# EAGLE board bms_slave (EAGLE 7.5.0)
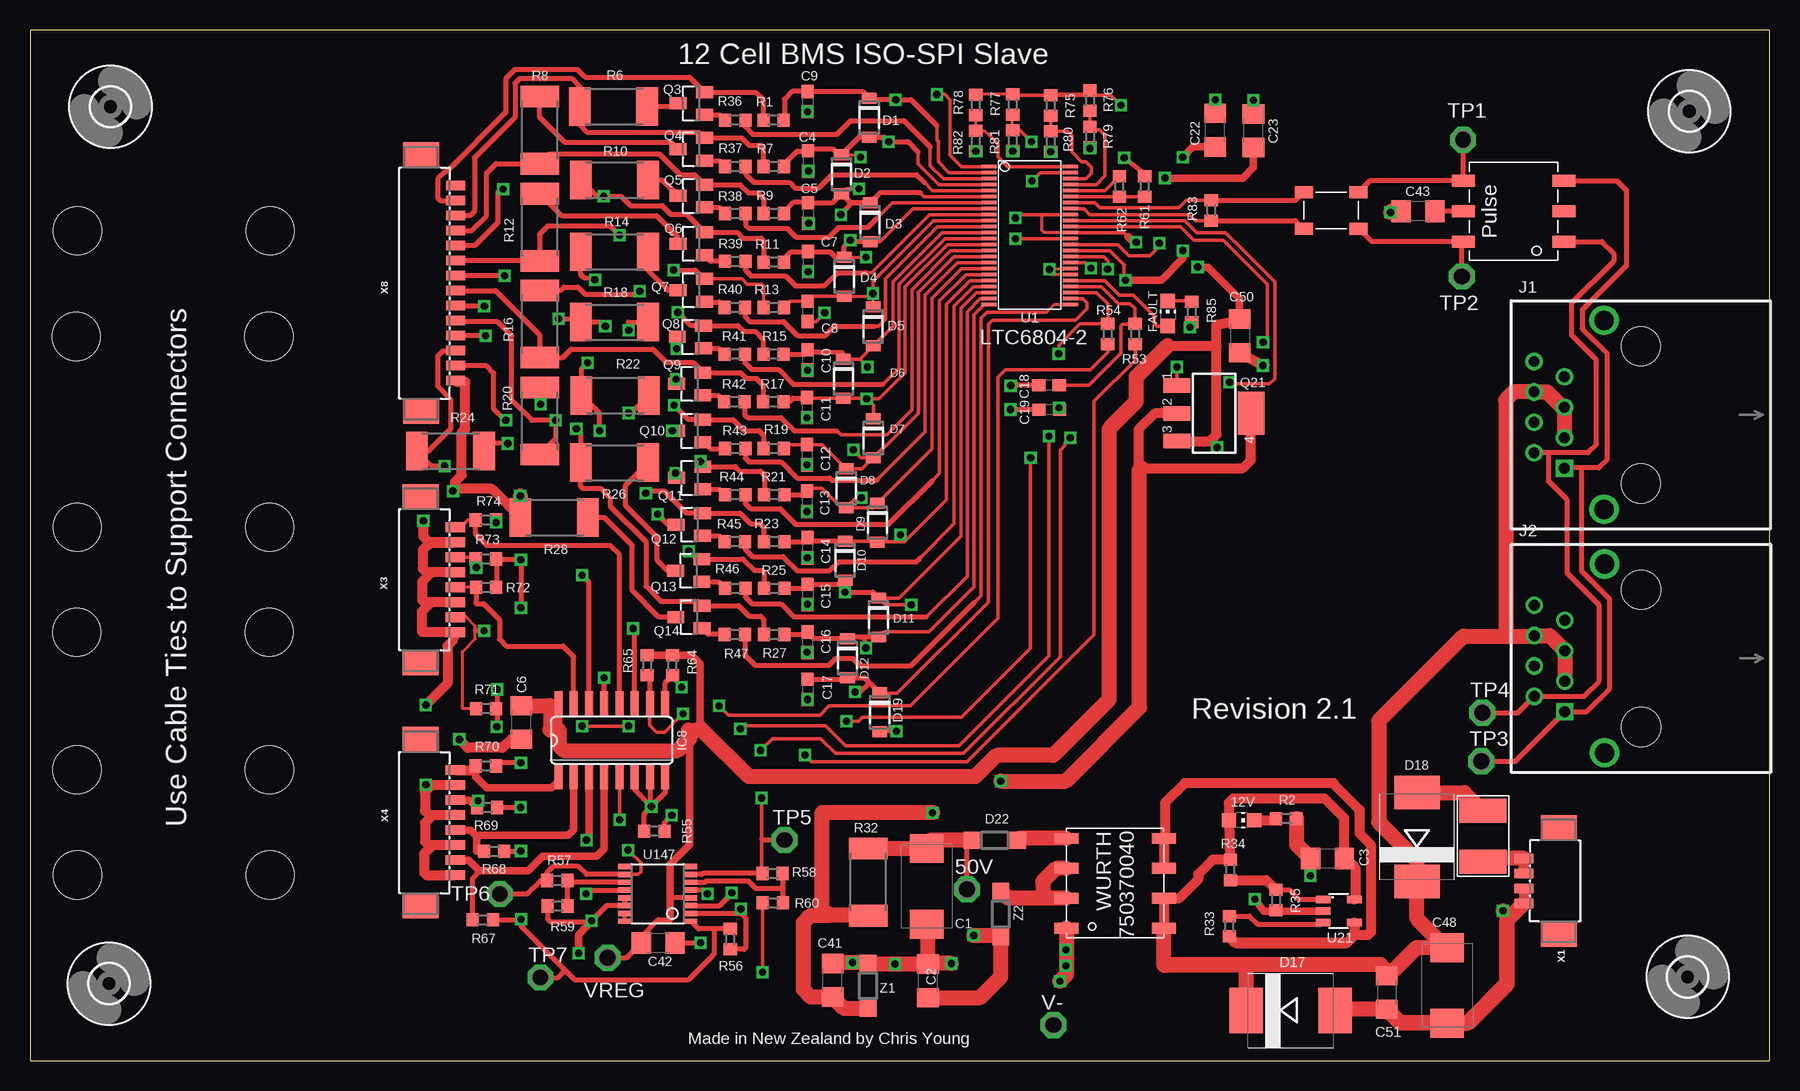
[diagram p2: board, top side]
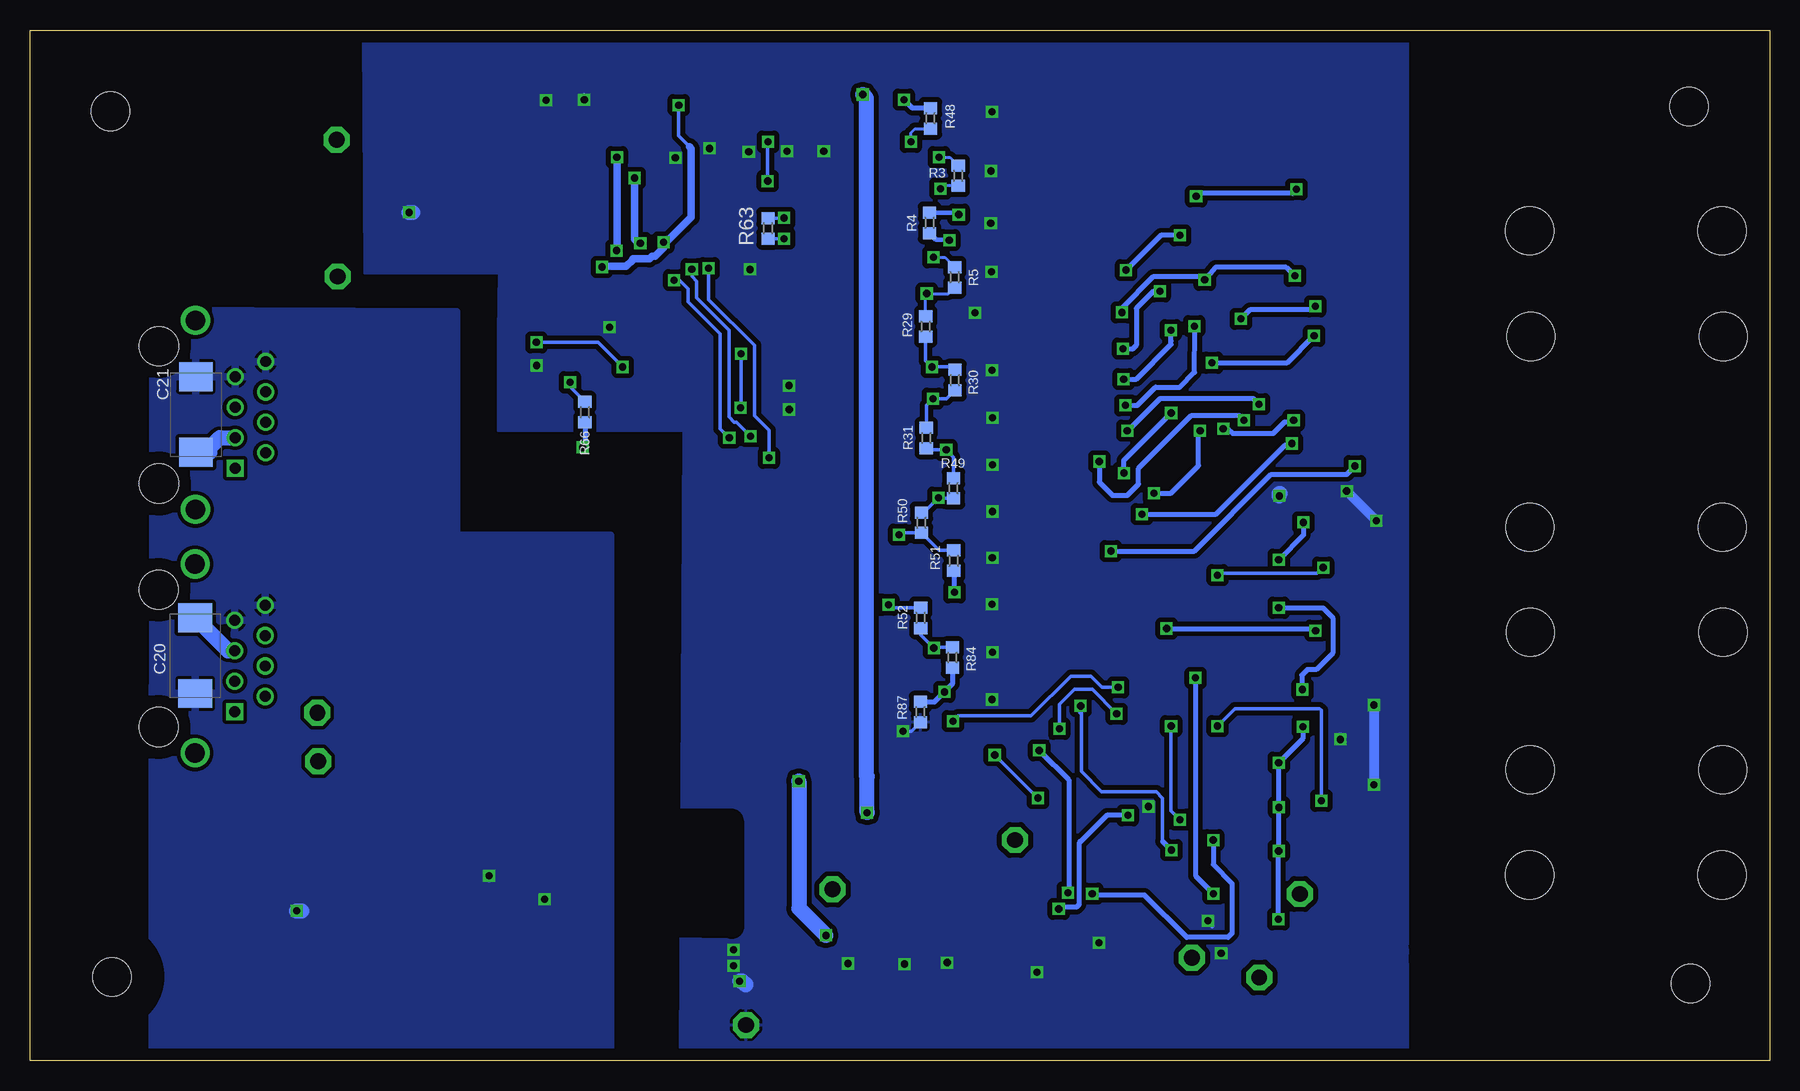
[diagram p3: board, bottom side, seen from below]

Size 145.01 x 85.89 mm. Coordinates in mm from the lower left corner, seen from the top.
Outline: 0,0 145.01,0 145.01,85.89 0,85.89 0,0
Copper layers (1*16): Top 0.035mm / dielectric 1.5mm / Bottom 0.035mm
Design rules "default *": minimum track width 6mil, minimum drill 12mil, track to track 6mil, track to pad 6mil, pad to pad 6mil, via to via 6mil, smd to smd 0mil, copper to edge 40mil, drill to drill 8mil, minimum pad ring 10mil, minimum via ring 8mil, stop-mask expansion 4mil, vias tented up to drill 0mil, thermal gap 10mil
Net classes: 0 default: drill 0.305 mm, clearance 0.152 mm; 1 POWER_12V: width 0.61 mm, drill 0.305 mm, clearance 0.254 mm to class 0, clearance 0.152 mm; 2 POWER_5V: width 0.61 mm, drill 0.305 mm, clearance 0.254 mm to class 0, clearance 0.254 mm to class 1, clearance 0.152 mm; 3 BMS V-: width 0.254 mm, drill 0.305 mm, clearance 0.152 mm to class 0, clearance 2 mm to class 1, clearance 2 mm to class 2, clearance 0.152 mm; 4 V-+1: width 0.254 mm, drill 0.305 mm, clearance 0.152 mm to class 0, clearance 2 mm to class 1, clearance 2 mm to class 2, clearance 0.152 mm to class 3, clearance 0.152 mm; 5 V-+2: width 0.254 mm, drill 0.305 mm, clearance 0.152 mm to class 0, clearance 2 mm to class 1, clearance 2 mm to class 2, clearance 0.33 mm to class 3, clearance 0.152 mm to class 4, clearance 0.152 mm; 6 V-+3: width 0.254 mm, drill 0.305 mm, clearance 0.152 mm to class 0, clearance 2 mm to class 1, clearance 2 mm to class 2, clearance 0.356 mm to class 3, clearance 0.33 mm to class 4, clearance 0.152 mm to class 5, clearance 0.152 mm; 7 V-+4: width 0.254 mm, drill 0.305 mm, clearance 0.152 mm to class 0, clearance 2 mm to class 1, clearance 2 mm to class 2, clearance 0.381 mm to class 3, clearance 0.356 mm to class 4, clearance 0.33 mm to class 5, clearance 0.152 mm to class 6, clearance 0.152 mm; 8 V-+5: width 0.254 mm, drill 0.305 mm, clearance 0.152 mm to class 0, clearance 2 mm to class 1, clearance 2 mm to class 2, clearance 0.406 mm to class 3, clearance 0.381 mm to class 4, clearance 0.356 mm to class 5, clearance 0.33 mm to class 6, clearance 0.152 mm to class 7, clearance 0.152 mm; 9 V-+6: width 0.254 mm, drill 0.305 mm, clearance 0.152 mm to class 0, clearance 2 mm to class 1, clearance 2 mm to class 2, clearance 0.432 mm to class 3, clearance 0.406 mm to class 4, clearance 0.381 mm to class 5, clearance 0.356 mm to class 6, clearance 0.33 mm to class 7, clearance 0.152 mm to class 8, clearance 0.152 mm; 10 V-+7: width 0.254 mm, drill 0.305 mm, clearance 0.152 mm to class 0, clearance 2 mm to class 1, clearance 2 mm to class 2, clearance 0.457 mm to class 3, clearance 0.432 mm to class 4, clearance 0.406 mm to class 5, clearance 0.381 mm to class 6, clearance 0.356 mm to class 7, clearance 0.33 mm to class 8, clearance 0.152 mm to class 9, clearance 0.152 mm; 11 V-+8: width 0.254 mm, drill 0.305 mm, clearance 0.152 mm to class 0, clearance 2 mm to class 1, clearance 2 mm to class 2, clearance 0.483 mm to class 3, clearance 0.457 mm to class 4, clearance 0.432 mm to class 5, clearance 0.406 mm to class 6, clearance 0.381 mm to class 7, clearance 0.356 mm to class 8, clearance 0.33 mm to class 9, clearance 0.152 mm to class 10, clearance 0.152 mm; 12 GND: width 0.406 mm, drill 0.305 mm, clearance 0.3 mm to class 0, clearance 0.381 mm to class 1, clearance 0.381 mm to class 2, clearance 0.483 mm to class 3, clearance 0.457 mm to class 4, clearance 0.432 mm to class 5, clearance 0.406 mm to class 6, clearance 0.381 mm to class 7, clearance 0.356 mm to class 8, clearance 0.33 mm to class 9, clearance 0.152 mm to class 10, clearance 0.152 mm to class 11, clearance 0.152 mm
Holes 4 mm at 20.02,69.16 19.91,60.35 19.99,44.45 19.94,35.71 19.96,24.26 20.02,15.47 3.96,69.16 3.86,60.35 3.94,44.45 3.89,35.71 3.91,24.26 3.96,15.47
bRestrict: area 86.5,11.2 to 91.4,20

## Footprints (pad centres in the part's own frame; a part is rotated, then mirrored left to right if it is on the bottom)
CHIP-LED0805 = smd 1.2 x 1.2: A 0,-1.05; C 0,1.05
P1-13 = drill 1.321 pad 2.159 octagon: TP 0,0
SMC_D = smd 2.4 x 2.8: + -3.15,0; - 3.15,0
C1206 = smd 1.6 x 1.8: 1 -1.4,0; 2 1.4,0
C0603@1 = smd 1.1 x 1: 1 -0.85,0; 2 0.85,0
C1206@1 = smd 1.6 x 1.8: 1 -1.4,0; 2 1.4,0
SOD123FL = smd 0.91 x 1.22: A 1.625,0; C -1.625,0
SMC = smd 2.8 x 3.8: A 3.7,0; C -3.7,0
SOD123 = smd 1.4 x 1.4: A 1.9,0; C -1.9,0
1812 = smd 2 x 3.9: P$1 0,-0.03; P$2 4.25,-0.03
3,2 = hole 3.2: 0,0
SO16 = smd 0.66 x 2.032: 1 -4.445,-3.073; 2 -3.175,-3.073; 3 -1.905,-3.073; 4 -0.635,-3.073; 5 0.635,-3.073; 6 1.905,-3.073; 7 3.175,-3.073; 8 4.445,-3.073; 9 4.445,3.073; 10 3.175,3.073; 11 1.905,3.073; 12 0.635,3.073; 13 -0.635,3.073; 14 -1.905,3.073; 15 -3.175,3.073; 16 -4.445,3.073
J0-C/D/E = drill 0.914 square: 1 4.445,-6.35 | drill 0.914: 2 3.175,-8.89; 3 1.905,-6.35; 4 0.635,-8.89; 5 -0.635,-6.35; 6 -1.905,-8.89; 7 -3.175,-6.35; 8 -4.445,-8.89 | drill 1.626: S1 -7.874,-3.048; S2 7.874,-3.048 | hole 3.251: -5.715,0; 5.715,0
SOT23 = smd 1 x 1.4: 1 -0.95,-1.1; 2 0.95,-1.1; 3 0,1.1
SOT223 = smd 1.219 x 2.235: 1 -2.311,-3.099; 2 0,-3.099; 3 2.311,-3.099 | smd 3.6 x 2.2: 4 0,3.099
R0603 = smd 1 x 1.1: 1 -0.85,0; 2 0.85,0
R2512 = smd 1.8 x 3.2: 1 -2.8,0; 2 2.8,0
SSOP48 = smd 0.3 x 1.25: 1 0.02,-0.01; 2 0.52,-0.01; 3 1.02,-0.01; 4 1.52,-0.01; 5 2.02,-0.01; 6 2.52,-0.01; 7 3.02,-0.01; 8 3.52,-0.01; 9 4.02,-0.01; 10 4.52,-0.01; 11 5.02,-0.01; 12 5.52,-0.01; 13 6.02,-0.01; 14 6.52,-0.01; 15 7.02,-0.01; 16 7.52,-0.01; 17 8.02,-0.01; 18 8.52,-0.01; 19 9.02,-0.01; 20 9.52,-0.01; 21 10.02,-0.01; 22 10.52,-0.01; 23 11.02,-0.01; 24 11.52,-0.01; 25 11.52,6.79; 26 11.02,6.79; 27 10.52,6.79; 28 10.02,6.79; 29 9.52,6.79; 30 9.02,6.79; 31 8.52,6.79; 32 8.02,6.79; 33 7.52,6.79; 34 7.02,6.79; 35 6.52,6.79; 36 6.02,6.79; 37 5.52,6.79; 38 5.02,6.79; 39 4.52,6.79; 40 4.02,6.79; 41 3.52,6.79; 42 3.02,6.79; 43 2.52,6.79; 44 2.02,6.79; 45 1.52,6.79; 46 1.02,6.79; 47 0.52,6.79; 48 0.02,6.79
TSOT23-5 = smd 0.62 x 1.22: 1 -0.95,-1.3; 2 0,-1.3; 3 0.95,-1.3; 4 0.95,1.3; 5 -0.95,1.3
TSSOP16 = smd 0.45 x 1.05: 1 -2.275,-2.768; 2 -1.625,-2.768; 3 -0.975,-2.768; 4 -0.325,-2.768; 5 0.325,-2.768; 6 0.975,-2.768; 7 1.625,-2.768; 8 2.275,-2.768; 9 2.275,2.768; 10 1.625,2.768; 11 0.975,2.768; 12 0.325,2.768; 13 -0.325,2.768; 14 -0.975,2.768; 15 -1.625,2.768; 16 -2.275,2.768
DLW43S = smd 1 x 1.5: P$1 0,0; P$2 0,4.572; P$3 3.048,4.572; P$4 3.048,0
T3001NL = smd 1.016 x 1.905: P$1 0,0; P$2 2.54,0; P$3 5.08,0; P$4 5.08,8.382; P$5 2.54,8.382; P$6 0,8.382
WE_750370040 = smd 2 x 0.9: P$1 0,0; P$2 0,2.49; P$3 0,4.98; P$4 0,7.47; P$5 8.14,7.47; P$6 8.14,4.98; P$7 8.14,2.49; P$8 8.14,0
PB-53261-04 = smd 0.8 x 1.6: 1 -1.875,1.1; 2 -0.625,1.1; 3 0.625,1.1; 4 1.875,1.1 | smd 2.1 x 3: MNT1 -4.425,-1.8; MNT2 4.425,-1.8
PB-53261-08 = smd 0.8 x 1.6: 1 -4.375,1.1; 2 -3.125,1.1; 3 -1.875,1.1; 4 -0.625,1.1; 5 0.625,1.1; 6 1.875,1.1; 7 3.125,1.1; 8 4.375,1.1 | smd 2.1 x 3: MNT1 -6.925,-1.8; MNT2 6.925,-1.8
PB-53261-14 = smd 0.8 x 1.6: 1 -8.125,1.1; 2 -6.875,1.1; 3 -5.625,1.1; 4 -4.375,1.1; 5 -3.125,1.1; 6 -1.875,1.1; 7 -0.625,1.1; 8 0.625,1.1; 9 1.875,1.1; 10 3.125,1.1; 11 4.375,1.1; 12 5.625,1.1; 13 6.875,1.1; 14 8.125,1.1 | smd 2.1 x 3: MNT1 -10.675,-1.8; MNT2 10.675,-1.8

## Placement (x,y rotation side)
12V  Green  [CHIP-LED0805]  100.99,20.04 270 top
50V  PTR1PAD1-13  [P1-13]  78.1,14.27 0 top
C1  1uF 100V  [SMC_D]  74.75,14.53 270 top
C2  4.7uF  [C1206]  74.85,6.65 90 top
C3  4.7uF  [C1206]  108.15,16.84 180 top
C4  100nF  [C0603@1]  64.87,74.98 270 top
C5  100nF  [C0603@1]  64.87,70.65 270 top
C6  0.1uF  [C1206]  40.94,28.18 270 top
C7  100nF  [C0603@1]  64.87,66.59 270 top
C8  100nF  [C0603@1]  64.82,62.45 270 top
C9  100nF  [C0603@1]  64.82,79.92 270 top
C10  100nF  [C0603@1]  64.82,58.41 270 top
C11  100nF  [C0603@1]  64.77,54.42 270 top
C12  100nF  [C0603@1]  64.77,50.5 270 top
C13  100nF  [C0603@1]  64.77,46.62 270 top
C14  100nF  [C0603@1]  64.8,42.75 270 top
C15  100nF  [C0603@1]  64.82,38.86 270 top
C16  100nF  [C0603@1]  64.8,34.87 270 top
C17  100nF  [C0603@1]  64.82,30.95 270 top
C18  10nF  [C0603@1]  84.94,56.29 180 top
C19  10nF  [C0603@1]  84.96,54.25 180 top
C20  10uF  [SMC_D]  131.24,33.76 270 bottom
C21  10uF  [SMC_D]  131.19,53.85 90 bottom
C22  1uF  [C1206]  98.78,77.55 90 top
C23  1uF  [C1206]  101.98,77.5 90 top
C41  0.1uF  [C1206]  66.9,6.71 90 top
C42  0.1uF  [C1206]  52.36,9.82 0 top
C43  100pF  [C1206@1]  115.7,70.79 180 top
C48  10uF  [SMC_D]  118.11,6.27 270 top
C50  1uF  [C1206]  100.84,60.4 270 top
C51  4.7uF  [C1206]  113.08,5.69 270 top
D1  [SOD123FL]  69.95,78.59 270 top
D2  [SOD123FL]  67.64,73.88 270 top
D3  [SOD123FL]  70.03,69.86 270 top
D4  [SOD123FL]  67.87,65.34 270 top
D5  [SOD123FL]  70.28,61.19 270 top
D6  [SOD123FL]  67.81,56.83 270 top
D7  [SOD123FL]  70.29,51.88 270 top
D8  [SOD123FL]  68.03,47.7 270 top
D9  [SOD123FL]  70.64,44.83 270 top
D10  [SOD123FL]  67.94,41.67 270 top
D11  [SOD123FL]  70.74,36.93 270 top
D12  [SOD123FL]  68.15,33.55 270 top
D17  [SMC]  105.08,4.19 0 top
D18  S3D  [SMC]  115.62,18.64 90 top
D19  [SOD123FL]  70.83,29.03 270 top
D22  CMHD459A  [SOD123]  80.42,18.36 0 top
F1  LITTLEFUSE_PTC  [1812]  121.08,16.56 90 top
FAULT  RED  [CHIP-LED0805]  94.84,62.27 0 top
H1  MOUNT-HOLE3.2  [3,2]  138.18,6.99 0 top
H2  MOUNT-HOLE3.2  [3,2]  138.3,79.12 0 top
H3  MOUNT-HOLE3.2  [3,2]  6.71,79.5 0 top
H4  MOUNT-HOLE3.2  [3,2]  6.58,6.43 0 top
IC8  4052D  [SO16]  48.5,26.7 0 top
J1  J0006D21  [J0-C/D/E]  134.26,53.82 270 top
J2  J0006D21  [J0-C/D/E]  134.29,33.53 270 top
Q3  SI2351  [SOT23]  55.12,79.77 90 top
Q4  SI2351  [SOT23]  55.12,75.95 90 top
Q5  SI2351  [SOT23]  55.12,72.06 90 top
Q6  SI2351  [SOT23]  55.12,68.08 90 top
Q7  SI2351  [SOT23]  55.12,64.2 90 top
Q8  SI2351  [SOT23]  55.05,60.31 90 top
Q9  SI2351  [SOT23]  54.99,56.4 90 top
Q10  [SOT23]  54.99,52.48 90 top
Q11  SI2351  [SOT23]  54.99,48.56 90 top
Q12  SI2351  [SOT23]  54.97,44.68 90 top
Q13  SI2351  [SOT23]  54.9,40.84 90 top
Q14  SI2351  [SOT23]  54.93,36.97 90 top
Q21  NSV1C201MZ4  [SOT223]  98.7,53.95 270 top
R1  100R  [R0603]  61.98,78.38 0 top
R2  3K3  [R0603]  104.72,20.17 180 top
R3  DNF  [R0603]  67.64,73.75 270 bottom
R4  DNF  [R0603]  70.03,69.82 270 bottom
R5  DNF  [R0603]  67.93,65.28 270 bottom
R6  33R  [R2512]  48.64,79.53 0 top
R7  100R  [R0603]  62,74.51 0 top
R8  33R  [R2512]  42.49,77.55 90 top
R9  100R  [R0603]  62,70.6 0 top
R10  33R  [R2512]  48.72,73.41 0 top
R11  100R  [R0603]  62,66.55 0 top
R12  33R  [R2512]  42.49,69.44 90 top
R13  100R  [R0603]  61.99,62.76 0 top
R14  33R  [R2512]  48.72,67.41 0 top
R15  100R  [R0603]  61.98,58.88 0 top
R16  33R  [R2512]  42.49,61.39 90 top
R17  100R  [R0603]  61.95,54.91 0 top
R18  33R  [R2512]  48.72,61.54 0 top
R19  100R  [R0603]  62.01,51.02 0 top
R20  33R  [R2512]  42.49,53.31 90 top
R21  100R  [R0603]  62.05,47.17 0 top
R22  33R  [R2512]  48.77,55.45 0 top
R23  100R  [R0603]  62.03,43.26 0 top
R24  33R  [R2512]  35.05,50.8 0 top
R25  100R  [R0603]  62.03,39.37 0 top
R26  33R  [R2512]  48.72,49.83 0 top
R27  100R  [R0603]  62.03,35.52 0 top
R28  33R  [R2512]  43.69,45.26 0 top
R29  DNF  [R0603]  70.35,61.19 270 bottom
R30  DNF  [R0603]  67.91,56.72 270 bottom
R31  DNF  [R0603]  70.29,51.89 270 bottom
R32  100R 2W  [R2512]  69.88,14.88 90 top
R33  130K  [R0603]  99.97,11.2 90 top
R34  100k  [R0603]  100.05,15.9 90 top
R35  22K1  [R0603]  103.86,13.39 90 top
R36  3K3  [R0603]  58.78,78.38 0 top
R37  3K3  [R0603]  58.8,74.51 0 top
R38  3K3  [R0603]  58.8,70.6 0 top
R39  3K3  [R0603]  58.78,66.61 0 top
R40  3K3  [R0603]  58.76,62.76 0 top
R41  3K3  [R0603]  58.75,58.88 0 top
R42  3K3  [R0603]  58.72,54.91 0 top
R43  3K3  [R0603]  58.79,51.02 0 top
R44  3K3  [R0603]  58.79,47.17 0 top
R45  3K3  [R0603]  58.76,43.26 0 top
R46  3K3  [R0603]  58.79,39.37 0 top
R47  3K3  [R0603]  58.75,35.52 0 top
R48  DNF  [R0603]  69.95,78.52 270 bottom
R49  DNF  [R0603]  68.03,47.7 270 bottom
R50  DNF  [R0603]  70.7,44.83 270 bottom
R51  DNF  [R0603]  68.01,41.67 270 bottom
R52  DNF  [R0603]  70.76,36.91 270 bottom
R53  100R  [R0603]  92.13,60.55 270 top
R54  100R  [R0603]  89.84,60.55 270 top
R55  10K  [R0603]  52.04,19.13 0 top
R56  4K99  [R0603]  58.37,10.13 270 top
R57  10K  [R0603]  43.95,15.02 0 top
R58  10K  [R0603]  61.9,15.61 0 top
R59  10K  [R0603]  43.98,12.89 0 top
R60  10K  [R0603]  61.93,13.16 0 top
R61  806R  [R0603]  92.91,72.85 90 top
R62  1K21  [R0603]  90.81,72.85 270 top
R63  LiNK  [R0603]  83.49,69.37 90 bottom
R64  10K  [R0603]  53.56,32.96 90 top
R65  10K  [R0603]  51.45,32.96 90 top
R66  1M  [R0603]  98.76,54.05 270 bottom
R67  78K7  [R0603]  37.74,11.73 0 top
R68  78K7  [R0603]  38.68,17.45 0 top
R69  78K7  [R0603]  38.1,21.11 0 top
R70  78K7  [R0603]  38,24.56 0 top
R71  78K7  [R0603]  38.02,29.34 0 top
R72  78K7  [R0603]  38.02,39.45 0 top
R73  78K7  [R0603]  38,41.81 0 top
R74  78K7  [R0603]  38,45.06 0 top
R75  [R0603]  85.09,79.6 270 top
R76  [R0603]  88.37,80.01 270 top
R77  [R0603]  81.91,79.68 270 top
R78  [R0603]  78.84,79.63 270 top
R79  [R0603]  88.37,76.99 270 top
R80  [R0603]  85.09,76.61 270 top
R81  [R0603]  81.91,76.68 270 top
R82  [R0603]  78.84,76.63 270 top
R83  120R  [R0603]  98.45,70.87 90 top
R84  DNF  [R0603]  68.12,33.6 270 bottom
R85  3K3  [R0603]  96.84,62.38 90 top
R87  100R  [R0603]  70.79,29.06 90 bottom
TP1  PTR1PAD1-13  [P1-13]  119.46,76.73 0 top
TP2  PTR1PAD1-13  [P1-13]  119.35,65.35 0 top
TP3  PTR1PAD1-13  [P1-13]  120.98,24.94 0 top
TP4  PTR1PAD1-13  [P1-13]  121.06,29.01 0 top
TP5  PTR1PAD1-13  [P1-13]  62.89,18.39 0 top
TP6  PTR1PAD1-13  [P1-13]  39.17,13.89 0 top
TP7  PTR1PAD1-13  [P1-13]  42.55,6.93 0 top
U1  LTC6804-2  [SSOP48]  79.96,74.52 270 top
U21  LT8300  [TSOT23-5]  109.09,12.47 270 top
U147  LT6005IGN  [TSSOP16]  52.32,13.89 90 top
U$1  DLW43SH510XK2  [DLW43S]  106.17,72.39 270 top
U$3  T3001NL  [T3001NL]  127.86,68.25 90 top
U$15  WURTH_750370040  [WE_750370040]  86.39,11.05 0 top
V-  PTR1PAD1-13  [P1-13]  85.32,2.97 0 top
VREG  PTR1PAD1-13  [P1-13]  48.16,8.59 0 top
X1  [PB-53261-04]  125.63,14.99 90 top
X3  [PB-53261-08]  34.37,40.08 270 top
X4  [PB-53261-08]  34.37,19.84 270 top
X8  [PB-53261-14]  34.39,64.8 270 top
Z1  CMHZ5265B  [SOD123]  69.85,6.25 90 top
Z2  CMMSH1-40  [SOD123]  80.92,12.22 90 top

## Tracks (layer width: path | path; a pad name or v marks a point on that pad's centre or on a via)
+12V
  Top 0.813: U$15.P$8 U$15.P$7 95.81,13.54 97.38,15.11 97.38,15.54 98.59,16.75 R34.2 99.97,20.01 12V.A 99.92,20.06 99.92,21.49 100.28,21.84 107.92,21.84 109.55,20.21 C3.1 109.7,16.84 110.46,16.08 110.46,13.49 U21.5
  Top 1.27: 94.69,7.95 101.4,7.95 101.4,4.19 D17.C | 94.69,7.95 94.53,7.95 U$15.P$8 | 118.03,9.42 115.62,11.84 D18.C 115.62,16.69 112.42,19.89 112.42,28.32 119.48,35.38 122.63,35.38 | 118.03,9.42 115.57,9.42 113.06,6.91 113.06,7.21 | 113.06,7.21 113.06,7.52 112.57,8 94.74,8 94.69,7.95 | C48.+ 118.03,9.42 | C51.1 113.08,7.19 113.06,7.21 | 122.63,35.38 125.35,35.38 J2.6 126.67,35.43 J2.5 J2.3 | 122.63,35.38 123.01,35.76 123.01,55.07 123.67,55.73 J1.6 126.44,55.73 127.71,54.46 J1.5 J1.3
  Bottom 1.27: J2.5 128.5,34.16 C20.+ | C21.+ 130.02,50.7 130.02,51.08 129.18,51.92 J1.3
A0
  Top 0.305: U1.45 88.88,73 89.61,73.74 89.61,77.11 89.15,77.57 88.43,77.57 R79.1 R76.2
A2  (via drill 0.6)
  Top 0.254: R81.1 R77.2
  Top 0.305: U1.47 84.21,74 v83.52,73.3 | R81.1 82.54,77.53 v83.49,76.58
  Bottom 0.305: v83.52,73.3 83.52,76.56 v83.49,76.58
BMS_VREF1  (via drill 0.6)
  Top 0.305: U1.35 90.7,68 90.7,67.98 91.59,67.08 93.35,67.08 94.13,67.87 v94.13,68.12 | v94.62,73.56 95.15,73.56
  Top 0.61: C23.1 101.98,74.45 101.09,73.56 v94.62,73.56
  Bottom 0.61: v94.13,68.12 94.28,68.12 94.62,68.45 v94.62,73.56
BMS_VREF2  (via drill 0.6)
  Top 0.305: v60.88,25.86 60.91,25.86 61.9,26.85 65.91,26.85 67.13,25.63 77.83,25.63 85.88,33.68 85.88,50.88 86.28,51.28 86.28,51.49 v86.72,51.92 | U1.34 90.03,67.5 91.19,66.34 | 91.19,66.34 91.21,66.34 | 91.19,66.34 91.19,65.18 v91.31,65.05
  Top 0.406: U147.3 57.5,12.92 58.17,13.59 58.17,13.66 v58.5,13.99
  Top 0.61: C22.1 96.95,76.15 v96.09,75.29 | v96.11,67.51 96.11,66.85 94.31,65.05 v91.31,65.05
  Bottom 0.305: 60.78,25.76 v60.88,25.86 | v91.31,65.05 90.86,65.05 90.14,64.34 90.14,63.25 87.48,60.58 87.48,52.68 v86.72,51.92
  Bottom 0.406: 60.78,25.76 58.42,23.39 58.42,14.07 v58.5,13.99
  Bottom 0.61: v96.09,75.29 96.09,67.54 v96.11,67.51
GND  (via drill 0.6)
  Top 0.61: R35.1 103.93,12.47 U21.2 102.84,12.47 v102.11,13.46 | C3.2 106.75,15.44 v106.73,15.42
  Top 0.813: X1.2 X1.1
  Top 1.27: C51.2 114.25,3.12 C48.- 119.89,3.12 123.11,6.35 123.11,11.7 X1.1 | C51.2 108.88,4.29 D17.A | R2.1 105.57,18.02 C3.2 | C51.2 113.15,4.29 113.18,4.32 113.18,4.22 114.17,3.23 119.89,3.23 123.14,6.48 123.14,12.14 v122.78,12.5
  Bottom 0.61: v106.73,15.42 106.76,15.16
  Bottom 1.27: v122.78,12.5 122.33,12.5
  pour Bottom (isolate 0.305): 109.45,62.43 134.77,62.53 134.82,0.18 96.6,0.28 96.6,43.79 109.45,43.79
N$1
  Top 0.406: Q14.3 52.41,36.97 50.19,39.19 50.19,42.95 47.88,45.26 R28.2
N$2
  Top 0.813: 12V.C 103.75,20.04 R2.2
N$3  (via drill 0.6)
  Top 0.254: D2.C 69.03,75.5 v69.24,75.29
  Top 0.305: U1.4 75.76,73 74.04,74.73 74.04,75.72
  Top 0.406: R7.2 62.85,74.69 63.96,75.79 64.83,75.79 C4.1 64.99,75.95 66.98,75.95 67.43,75.5 D2.C 69.1,76.96 D1.A 71.2,76.96 v71.58,76.58 73.18,76.58 74.04,75.72
  Bottom 0.254: v71.58,76.58 71.58,77.32 71.25,77.65 69.98,77.65 R48.2 | v69.24,75.29 68.33,75.29 R3.1
N$4  (via drill 0.6)
  Top 0.305: U1.38 95.9,69.5 97.03,68.38 99.47,68.38 103.15,64.69 103.15,60.22 v102.79,59.87 | v95.61,57.81 Q21.1
  Bottom 0.305: v102.79,59.87 97.66,59.87 v95.61,57.81
N$5
  Top 0.305: U1.5 75.25,72.5 74.55,73.2
  Top 0.406: R37.2 59.65,73.88 60.2,73.33 60.22,73.33 60.35,73.2 63.3,73.2 63.78,72.72 65.74,72.72 66.85,73.84 73.91,73.84 74.55,73.2
N$6
  Top 0.406: U$3.P$3 132.28,73.33 133.07,72.54 133.07,66.24 129.39,62.56 129.39,61.01 131.42,58.98 131.42,50.04 130.78,49.4 129.39,49.4 | 129.39,49.4 127.94,49.4 J1.1 | 129.39,49.4 129.34,49.35 129.34,40.79 131.67,38.46 131.67,31.01 129.74,29.08 J2.1 123.8,24.94 TP3.TP
N$7
  Top 0.406: Q13.3 53.14,40.84 52.27,41.71 52.27,43.61 49.66,46.23 49.66,47.98 R26.2
N$8
  Top 0.305: U1.21 78.63,64.5 77.01,62.89 77.01,44.76 76.86,44.6 76.86,44.58 74.17,41.88
  Top 0.406: R45.2 59.61,42.62 60.22,42.01 62.79,42.01 63.98,40.82 66.62,40.82 67.39,41.58 73.86,41.58 74.17,41.88
N$9
  Top 0.406: U$3.P$1 131.04,68.25 132,67.28 132,66.62 128.5,63.12 128.5,60.48 130.53,58.45 130.53,51.31 129.87,50.65 126.59,50.65 | 126.59,50.65 J1.2 | 126.59,50.65 126.59,48.28 128.14,46.74 128.14,40.64 130.81,37.97 130.81,31.62 129.54,30.35 J2.2 124.03,28.98 TP4.TP
N$11  (via drill 0.6)
  Top 0.406: R56.2 58.38,9.27 59.54,9.27 59.66,9.4 59.66,11.89 59.28,12.27 U147.2 59.26,12.27 59.28,12.29 59.26,12.24 v59.26,12.65 | R55.2 52.89,19.85 v53.49,20.45
  Bottom 0.406: v53.49,20.45 55.25,20.45 57.4,18.29 57.43,18.29 57.56,18.16 57.56,13.01 57.76,12.8 59.11,12.8 v59.26,12.65
N$12
  Top 0.305: U1.42 88.77,71.5 89.2,71.07 95.76,71.07 96.39,71.7 98.44,71.7 R83.2
  Top 0.406: R83.2 105.5,71.72 U$1.P$1
N$13  (via drill 0.6)
  Top 0.254: v69.11,72.67 68.06,72.67 D2.A
  Top 0.305: U1.6 74.53,72 74.19,72.34
  Top 0.406: R9.2 62.85,70.72 63.7,71.58 64.79,71.58 C5.1 66.89,71.5 D2.A 68.4,71.49 D3.C | 74.19,72.34 70.88,72.34 D3.C | v67.59,70.51 68.49,71.48 D3.C
  Bottom 0.254: R3.2 68.88,72.9 v69.11,72.67
  Bottom 0.406: R4.1 67.65,70.7 v67.59,70.51
N$14  (via drill 0.6)
  Top 0.305: 75.57,77.95 75.62,77.9 75.62,76.71 75.72,76.61 75.72,74.91 76.62,74 U1.2
  Top 0.406: R1.2 62.89,78.45 62.89,80.14 63.52,80.77 C9.1 69.39,80.77 D1.C 70.08,80.09 v72.16,80.09 73.43,80.09 75.57,77.95
  Bottom 0.406: R48.1 71.45,79.37 v72.16,80.09
N$15  (via drill 0.6)
  Top 0.406: Q11.3 53.89,48.9 v53.82,48.97 | v49.89,53.98 50.09,53.98 R22.2
  Bottom 0.406: v53.82,48.97 53.82,50.04 v49.89,53.98
N$16  (via drill 0.6)
  Top 0.254: D4.C 69.69,66.97 v69.7,66.95
  Top 0.305: U1.8 73.62,71 70.87,68.25 70.04,68.25 D3.A
  Top 0.406: D3.A 68.69,68.24 v68.38,68.38 67.87,67.87 D4.C 67.15,66.97 66.73,67.39 64.92,67.39 C7.1 64.85,67.41 63.42,67.41 62.85,66.84 R11.2
  Bottom 0.254: v69.7,66.95 68.76,66.95 R5.1
  Bottom 0.406: v68.38,68.38 69.48,68.43 R4.2
N$17  (via drill 0.6)
  Top 0.305: Q10.2 58.64,53.43 59.54,52.53 60.81,52.53 61.14,52.2 61.14,51.1 61.14,51.04 R19.1
  Top 0.406: 45.94,61.52 R18.1 | v37.87,62.87 35.55,62.87 X8.9 | 61.16,51.08 61.16,52.12 60.78,52.5 59.51,52.5 58.59,53.43 Q10.2 54.88,53.43 v53.7,54.61 | 61.16,51.08 61.24,51 | 61.16,51.08 61.14,51.1 | 47.98,61.19 v47.96,61.21 47.63,61.54 R18.1 | v44.07,61.82 45.64,61.82 R18.1
  Bottom 0.406: v37.87,62.87 38.18,62.56 43.33,62.56 v44.07,61.82 | v53.7,54.61 52.71,54.61 51.18,56.13 49.15,56.13 47.93,57.35 47.9,60.86 v47.96,61.21
N$18
  Top 0.305: U1.29 89.61,65 90.81,63.8 91.97,63.8 93.73,62.05 93.73,61.42 93.93,61.21 FAULT.A
N$19
  Top 0.406: R6.2 53.78,79.53 Q3.3
N$20  (via drill 0.6)
  Top 0.254: D4.A 70.04,63.72 v70.26,63.93 70.28,63.91 D5.C
  Top 0.305: v70.26,63.93 70.26,64.95 75.31,70 U1.10 | D4.A 65.24,63.72 C8.1 64.8,63.27 63.35,63.27 R13.2
  Bottom 0.254: R5.2 68.43,63.93 v70.26,63.93 70.35,63.84 R29.1
N$21
  Top 0.305: U1.23 79.2,63.5 78.13,62.43 78.13,40.39 74.7,36.96
  Top 0.406: R46.2 59.64,38.63 60.2,38.08 62.59,38.08 63.7,36.96 74.7,36.96
N$22
  Top 0.254: 79.96,77.11 79.6,77.47 78.85,77.47 R82.1 R78.2
  Top 0.305: U1.48 81.48,74.5 80.67,75.31 80.67,76.4 79.96,77.11
N$23
  Top 0.406: R8.2 42.49,78.61 44.58,76.53 53.43,76.53 Q4.3
N$24  (via drill 0.6)
  Top 0.305: D6.C 69.18,58.46 | 69.18,58.46 v69.82,57.81 | 69.18,58.46 D5.A 71.93,61.22 71.93,64.92 76.01,69 U1.12
  Top 0.406: R15.2 64.62,58.88 C10.1 64.87,59.03 65.84,59.03 67.7,59.02 D6.C
  Bottom 0.305: R30.1 68.15,57.81 v69.82,57.81 70.35,58.33 R29.2
N$25
  Top 0.305: 96.57,63.25 R85.2 96.75,63.32 FAULT.C
N$27
  Top 0.406: R10.2 52.67,73.41 Q5.3
N$28  (via drill 0.6)
  Top 0.305: v69.75,55.17 69.71,55.21 D6.A 64.83,55.21 C11.1 | v69.75,55.17 69.77,55.14 70.76,55.14 72.95,57.33 72.95,64.49 76.46,68 U1.14 | D7.C 70.29,54.62 v69.75,55.17
  Top 0.406: R17.2 63.3,54.91 63.6,55.22 64.72,55.22 C11.1
  Bottom 0.305: R30.2 68.61,55.17 v69.75,55.17 70.29,54.62 R31.1
N$29
  Top 0.406: U$3.P$5 C43.1
N$30
  Top 0.305: U1.3 76.13,73.5 75.03,74.6 75.03,76.15
  Top 0.406: R36.2 59.63,77.81 60.25,77.19 67.26,77.19 68.4,78.33 72.85,78.33 75.03,76.15
N$31
  Top 0.406: R12.2 44.3,70.43 52.22,70.43 53.95,68.71 53.95,68.15 Q6.3
N$32  (via drill 0.6)
  Top 0.305: D7.A 69.28,50.26 v68.63,50.9 | R19.2 63.19,51.34 C12.1 64.78,51.33 66.01,51.33 68.02,49.33 D8.C 69.37,49.33 D7.A | D7.A 71.02,50.98 71.09,50.98 74.07,53.95 74.07,64.03 77.04,67 U1.16
  Bottom 0.305: R31.2 70.15,50.9 v68.63,50.9 68.03,50.3 R49.1
N$34
  Top 0.305: U1.7 71.91,71.5 70.54,70.13
  Top 0.406: R38.2 59.65,69.64 59.92,69.37 63.12,69.37 63.86,68.63 66.62,68.63 67.44,69.44 69.85,69.44 70.54,70.13
N$35
  Top 0.406: Q7.3 53.17,64.2 51.54,65.84 51.54,67.39 R14.2
N$36  (via drill 0.6)
  Top 0.305: D8.A 70.26,46.08 D9.C 75.18,51 75.18,63.55 77.64,66 U1.18 | D8.A 67.67,46.08 66.04,47.7 64.95,47.7 C13.1 | v69.29,46.91 68.87,46.91 D8.A
  Top 0.406: R21.2 64.47,47.17 C13.1
  Bottom 0.305: R49.2 69.23,46.85 v69.29,46.91 70.52,45.68 R50.1
N$37
  Top 0.305: 69.7,65.66 70.15,65.66 75,70.5 U1.9
  Top 0.406: R39.2 59.63,65.88 60.1,65.41 62.97,65.41 63.8,64.57 66.19,64.57 67.31,65.68 69.67,65.68 69.7,65.66
N$38
  Top 0.305: 70.38,61.19 70.74,61.19 71.32,61.77 71.32,65.18 75.65,69.5 U1.11
  Top 0.406: R40.2 59.61,61.98 59.99,61.59 62.81,61.59 63.86,60.55 63.86,60.53 63.88,60.5 63.91,60.5 63.98,60.43 66.29,60.43 67.06,61.19 70.38,61.19
N$39  (via drill 0.6)
  Top 0.406: R16.2 44.23,64.19 44.5,64.47 45.67,64.47 46.25,63.88 50.6,63.88 v50.83,64.11 | v53.9,59.33 53.9,60.26 Q8.3
  Bottom 0.406: v50.83,64.11 51.36,64.11 52.78,62.69 52.78,59.64 53.11,59.31 53.87,59.31 v53.9,59.33
N$40  (via drill 0.6)
  Top 0.305: U1.20 78.36,65 76.4,63.04 76.4,46.74 72.9,43.23 72.57,43.23 | 72.57,43.23 71.15,43.23 | 71.15,43.23 70.66,43.23 D9.A | v72.57,43.84 72.57,43.23 | D10.C 71.08,43.29 71.15,43.23
  Top 0.406: D10.C 65.1,43.29 C14.1 64.45,43.26 R23.2
  Bottom 0.305: v72.57,43.84 72.43,43.98 R50.2 69.24,42.52 R51.1
N$41
  Top 0.305: 71.12,56.39 72.44,57.71 72.44,64.69 76.25,68.5 U1.13
  Top 0.406: R41.2 59.6,58.15 60.15,57.61 62.38,57.61 63.6,56.39 71.12,56.39
N$42
  Top 0.305: 67.26,52.48 67.59,52.15 71.42,52.15 73.51,54.23 73.51,64.26 76.75,67.5 U1.15
  Top 0.406: R42.2 59.57,53.84 59.82,53.59 62.61,53.59 63.73,52.48 67.26,52.48
N$43  (via drill 0.6)
  Top 0.406: Q9.3 53.89,56.75 v53.85,56.79 | v49.91,60.88 49.89,61.54 R18.2
  Bottom 0.406: v53.85,56.79 52.78,56.79 49.89,59.69 49.89,59.97 v49.91,60.88
N$44  (via drill 0.6)
  Top 0.305: U1.22 78.89,64 78.89,63.98 77.6,62.69 77.6,43.69 72.44,38.53 70.76,38.53 D11.C 71.3,38 v73.46,38
  Top 0.406: R25.2 64.48,39.37 C15.1 67.61,39.71 D10.A v67.95,39.04 70.26,39.04 D11.C
  Bottom 0.305: R52.1 73.21,37.76 v73.46,38
  Bottom 0.406: v67.95,39.04 67.95,40.76 R51.2
N$45  (via drill 0.6)
  Top 0.406: Q10.3 53.57,52.48 v53.54,52.5 | v42.57,54.71 42.57,56.04 R20.2
  Bottom 0.406: v53.54,52.5 53.49,52.5 50.8,55.19 43.05,55.19 v42.57,54.71
N$46
  Top 0.305: 70.61,48.41 74.6,52.4 74.6,63.78 77.32,66.5 U1.17
  Top 0.406: R43.2 59.64,50.19 59.92,49.91 62.59,49.91 63.96,48.54 66.68,48.54 66.85,48.36 70.56,48.36 70.61,48.41
N$47
  Top 1.27: D18.A 119.58,22.34 F1.P$2
N$48  (via drill 0.6)
  Top 0.305: U1.24 79.54,63 78.69,62.15 78.69,39.5 74.96,35.76 71.2,35.76 D11.A | v69.67,34.39 69.67,34.93 69.29,35.31
  Top 0.406: R27.2 64.59,35.52 C16.1 65.34,35.18 D12.C 68.28,35.31 69.29,35.31 D11.A
  Bottom 0.305: R52.2 70.76,35.48 v69.67,34.39 69.61,34.45 R84.1
N$49
  Top 0.406: R60.2 62.78,14.35 | 62.78,14.35 62.78,14.86 | 62.78,14.86 62.78,15.58 R58.2 | 62.77,14.87 62.78,14.86 | 62.78,14.35 62.67,14.25 62.55,14.38 60.48,14.38 59.87,14.99 56.39,14.99 56.27,14.87 U147.6
N$50
  Top 0.406: U$1.P$3 111.84,68.25 U$3.P$6 119.35,68.12 TP2.TP
N$51
  Top 0.406: U$1.P$2 111.68,73.33 U$3.P$4 119.48,76.71 TP1.TP
N$52
  Top 0.406: 50V.TP 78.11,17.95 D22.C
  Top 1.27: D22.C 74.98,18.36 74.17,17.55 74.62,17.55 C1.+ R32.2
N$53
  Top 0.254: 85.1,77.44 R80.1 R75.2
  Top 0.305: U1.46 88.03,73.5 88.49,73.97 88.49,74.45 88.01,74.93 87.66,74.93 86.84,75.74 86.84,77.11 86.49,77.47 85.1,77.47 R80.1
N$54
  Top 0.813: X1.3 X1.4
  Top 1.27: X1.4 121.41,16.86 F1.P$1
N$56  (via drill 0.6)
  Top 0.813: Q21.2 93.75,53.95 92.41,52.6 92.41,49.66 92.68,49.38 101.09,49.38 101.75,50.04 101.75,53.9 Q21.4
  Top 1.27: C2.1 79.19,5.25 80.92,6.99 Z2.C 80.8,10.44 v78.66,10.44 | 92.68,49.38 92.53,49.38 92.48,49.33 92.48,29.44 86.33,23.29 v80.92,23.29
  Bottom 1.27: v80.92,23.29 80.92,12.7 v78.66,10.44
N$57
  Top 0.406: R6.1 45.85,77.98 46.46,77.37 55.75,77.37 Q4.2 59.32,76.9 59.94,76.28 60.86,76.28 61.11,76.02 61.11,74.55 R7.1 | R6.1 | R6.1 45.85,81.18 45.21,81.81 40.79,81.81 40.44,81.46 40.44,78.64 37.06,75.26 37.06,70.79 36.7,70.43 35.51,70.43 X8.3
N$59
  Top 0.406: X8.4 36.79,69.17 38.05,70.43 38.05,73.97 38.84,74.75 R8.1 43.31,75.56 52.45,75.56 54.18,73.84 55.39,73.84 Q5.2 59.2,73.01 59.89,72.31 60.66,72.31 61.14,71.83 61.14,70.61 R9.1
N$64
  Top 1.27: U$15.P$4 82.47,18.52 D22.A
N$65
  Top 0.406: X8.8 38.8,64.17 42.42,60.55 42.47,60.55 42.47,58.62 R16.1 44.39,58.59 45.11,59.31 51.92,59.31 53.04,58.19 55.25,58.19 Q9.2 59.21,57.35 59.69,56.87 60.53,56.87 61.11,56.29 61.11,54.93 R17.1
N$66  (via drill 0.6)
  Top 0.406: 45.9,65.53 46.2,65.23 v47.09,65.08 | 45.9,65.53 45.9,67.39 R14.1 | 45.9,65.53 45.9,65.51 46.15,65.25 | v39.57,65.41 35.51,65.41 X8.7 | R15.1 61.11,58.89 61.11,60.1 60.43,60.78 59.51,60.78 59.03,61.26 Q8.2 55.1,61.26 v54,62.36
  Bottom 0.406: v39.57,65.41 40.28,66.12 46.2,66.12 v47.09,65.08 47.22,65.35 51.36,65.35 54,62.71 v54,62.36
N$67
  Top 1.27: U$15.P$2 84.46,13.54 | 84.46,13.54 81.5,13.54 Z2.A | U$15.P$3 85.52,16.03 84.43,14.94 84.43,13.56 84.46,13.54
N$68  (via drill 0.6)
  Top 0.406: R20.1 43.82,51.84 v43.82,53.37 41.83,53.37 40.16,55.04 40.16,60.4 38.99,61.57 35.59,61.57 X8.10 | R21.1 61.24,47.2 61.24,48.77 60.88,49.12 59.18,49.12 58.79,49.52 Q11.2 56.09,49.73 v55.88,49.94
  Bottom 0.406: v55.88,49.94 55.88,48.21 54.79,47.12 53.54,47.12 52.6,48.06 52.6,49.35 48.18,53.77 44.22,53.77 v43.82,53.37
N$69  (via drill 0.6)
  Top 0.406: 45.97,54.15 R22.1 | R22.1 45.97,54.87 | R22.1 45.97,57.65 v46.48,58.17 | v37.97,60.4 35.51,60.4 X8.11 | R23.1 61.16,43.27 61.16,44.45 60.86,44.76 60.05,44.76 59.17,45.63 Q12.2 54.73,45.63 52.91,47.45 51.49,47.45 v51.33,47.3 | v47.47,52.5 47.47,53.94 R22.1
  Bottom 0.406: v46.48,58.17 40.21,58.17 v37.97,60.4 | v51.33,47.3 49.89,47.3 47.6,49.58 47.6,52.38 v47.47,52.5
N$70
  Top 0.813: U$15.P$6 U$15.P$5 94.62,18.61 94.62,21.49 96.27,23.14 108.66,23.14 108.66,23.09 110.82,20.93 110.82,18.95 111.76,18.01 111.76,10.79 111.81,10.74 111.56,10.49 110.41,10.49 109.73,9.8 100.48,9.8 99.97,10.31 R33.1 100.5,9.83 109.8,9.83 110.39,10.42 U21.4
N$71  (via drill 0.6)
  Top 0.406: v34.57,49.55 33.5,49.55 R24.1 33.2,50.8 35.1,52.7 35.1,55.09 34.01,56.19 34.01,58.75 34.42,59.16 35.48,59.16 X8.12 | R25.1 61.19,39.38 61.19,40.69 61.01,40.87 60.38,40.87 59.45,41.79 Q13.2 55.59,41.79 v54.91,42.47
  Bottom 0.406: v34.57,49.55 35.26,48.87 41.55,48.87 47.96,42.47 v54.91,42.47
N$72  (via drill 0.6)
  Top 0.406: v45.54,52.65 45.92,52.28 R26.1 45.9,49.81 45.9,47.85 46.05,47.7 47.55,47.7 48.36,46.89 48.36,46.2 51.33,43.23 51.33,39.52 52.58,38.28 55.67,38.28 Q14.2 59.08,37.92 59.94,37.06 60.91,37.06 61.16,36.8 61.16,35.53 R27.1 | v39.67,53.37 39.6,53.37 38.66,54.3 38.66,57.3 38.05,57.91 35.5,57.91 X8.13
  Bottom 0.406: v45.54,52.65 45.14,52.65 44.75,52.27 41.38,52.27 40.41,53.24 39.8,53.24 v39.67,53.37
N$74
  Top 0.305: U1.19 78,65.5 75.82,63.32 75.82,48.95 75.21,48.34
  Top 0.406: R44.2 59.64,46.43 60.07,46 62.53,46 63.83,44.7 71.58,44.7 75.21,48.34
N$75
  Top 0.406: R33.2 101.66,12.05 102.36,11.35 107.63,11.35 U21.3
N$76
  Top 0.406: U21.1 105.83,13.42 105.05,14.2 103.9,14.2 R35.2 103.73,14.37
  Top 0.813: R34.1 103.05,15.05 R35.2
N$77  (via drill 0.6)
  Top 0.305: U1.26 87.75,63.5 88.09,63.17 88.09,62.66 87.15,61.72 80.21,61.72 79.88,61.39 79.88,38.2 72.29,30.61 70.88,30.61 D19.C
  Top 0.406: C17.1 68.02,31.8 D12.A 69.56,31.93 69.97,31.52 | 69.97,31.52 D19.C | v68.78,30.73 69.19,30.73 69.97,31.52
  Bottom 0.406: R84.2 68.12,31.39 v68.78,30.73 69.61,29.91 R87.2
N$78
  Top 0.406: R47.1 56.53,35.52 Q14.1
N$79
  Top 0.406: Q13.1 57.42,39.89 R46.1
N$80
  Top 0.406: Q12.1 57.44,43.73 R45.1
N$81
  Top 0.406: Q11.1 57.49,47.62 R44.1
N$82
  Top 0.406: Q10.1 56.17,51.53 56.69,51 57.93,51 R43.1
N$83
  Top 0.406: Q9.1 57.34,55.45 R42.1
N$84
  Top 0.406: Q8.1 57.42,59.36 R41.1
N$85
  Top 0.305: R40.1 57.58,62.76 | 56.25,63.22 Q7.1
  Top 0.406: 56.25,63.22 57.46,63.22 R40.1
N$86
  Top 0.406: R39.1 56.74,66.61 Q6.1
N$87
  Top 0.406: Q5.1 57.44,71.11 R38.1
N$88
  Top 0.406: Q4.1 57.47,75 R37.1
N$89
  Top 0.406: X8.2 34.21,71.68 33.99,71.91 33.99,73.48 34.54,74.04 34.67,74.04 39.65,79.02 39.65,81.84 40.41,82.6 45.64,82.6 46.28,81.97 54.97,81.97 Q3.2 56.29,80.64 60.54,80.64 61.13,80.06 R1.1
N$90
  Top 0.406: Q3.1 57.49,78.82 R36.1
N$92
  Top 0.305: U1.41 86.76,70.99 87.86,70.99 88.37,70.48 96.62,70.48 97.13,69.98 98.41,69.98 R83.1
  Top 0.406: R83.1 105.5,70.02 U$1.P$4
N$96  (via drill 0.6)
  Top 0.406: v56.46,13.92 56.46,14.05 56.31,14.2 55.11,14.2 U147.5
  Top 0.61: IC8.3 46.6,18.61 v46.38,18.39
  Bottom 0.406: v46.38,18.39 46.38,16.33 44.81,14.76 44.81,10.62 45.14,10.29 48.59,10.29 52.1,13.79 56.34,13.79 v56.46,13.92
N$97  (via drill 0.6)
  Top 0.305: R53.2 92.13,58.37 88.7,54.94 88.7,35.51 78.11,24.92 65.1,24.92 65.1,24.97 v64.59,25.48 | v60.99,21.89 60.99,18.49 60.99,15.67 R58.1
  Top 0.406: 55.12,15.49 U147.7 56.01,15.52 56.1,15.61 R58.1 | TP5.TP 61.09,18.39 60.99,18.49
  Bottom 0.305: v60.99,21.89 61.01,21.89 v64.59,25.48
N$98  (via drill 0.6)
  Top 0.305: R54.2 89.84,59.03 88.39,57.58 81.31,57.58 80.7,56.97 80.7,36.85 73.41,29.57 66.62,29.57 65.84,28.78 58.22,28.78 v57.43,29.57 | U147.10 50.7,15.52 50.93,15.75 50.93,16.48 v49.86,17.55
  Top 0.406: U147.10 46.38,15.52 45.69,16.2 43.61,16.2 43.1,15.7 R57.1 43.09,15.01 42.55,15.01 41.43,13.89 TP6.TP
  Bottom 0.305: 50.6,18.29 50.6,21.87 51.13,22.4 55.68,22.4 57.38,24.11 57.38,29.52 v57.43,29.57
  Bottom 0.406: v57.43,29.57 57.43,29.03 | 50.6,18.29 v49.86,17.55
N$99  (via drill 0.6)
  Top 0.406: IC8.13 v47.87,31.89 v47.85,31.9 | v46.36,13.92 46.38,13.92 46.69,14.22 U147.12
  Bottom 0.406: v47.85,31.9 47.85,15.42 v46.36,13.92
N$100  (via drill 0.6)
  Top 0.305: U1.27 88.9,64 89.84,63.07 R54.1 87.54,61.4 85.75,59.61 v85.75,58.9 | v85.78,54.41 85.83,54.47 C19.1
  Bottom 0.305: v85.75,58.9 85.75,54.43 v85.78,54.41
N$101
  Top 0.305: U1.28 89.32,64.5 90.73,63.09 91.69,63.09 92.1,62.69 92.1,61.43 R53.1 92.09,61.37 91.06,61.37 90.96,61.27 90.96,58.95 88.29,56.29 C18.1
N$102  (via drill 0.6)
  Top 0.305: U1.32 87.98,66.5 v88.44,66.04 | v83.41,50.24 83.41,34.39 77.65,28.63 69.39,28.63 69.06,28.3 v68.07,28.3 | R64.1 53.56,31.86 v54.31,31.11
  Top 0.406: IC8.9 52.95,31.5 R64.1
  Bottom 0.305: v88.44,66.04 88.44,63.42 84.63,59.61 84.63,53.75 83.41,52.53 v83.41,50.24 | v54.31,31.11 55.65,31.11 56.59,32.05 58.24,32.05 61.57,28.73 67.64,28.73 v68.07,28.3
N$103  (via drill 0.6)
  Top 0.305: v84.94,52.05 84.94,33.76 77.44,26.26 67.97,26.26 66.32,27.91 59.46,27.91 v59.21,27.66 | v54.43,28.91 54.41,28.91 52.88,27.38 52.22,27.38 51.66,27.94 51.66,29.76 IC8.10 | v89.84,65.96 89.84,66.67 89.51,67 U1.33
  Top 0.406: IC8.10 51.68,31.88 R65.1
  Bottom 0.305: v59.21,27.66 59.21,29.69 57.96,30.94 56.46,30.94 v54.43,28.91 | v84.94,52.05 86.11,53.21 86.31,53.21 86.74,53.65 86.74,60.88 89.43,63.58 89.43,64.97 89.84,65.38 v89.84,65.96
N$104
  Top 0.406: U147.11 44.96,14.87 R57.2 44.83,15 R59.2
N$105
  Top 0.305: U1.44 89.61,72.5 R62.1
N$106
  Top 0.305: U1.43 R62.2 R61.1
N$107  (via drill 0.6)
  Top 0.254: v82.14,68.5 R63.1
  Top 0.305: U1.36 83.52,68.5 v82.14,68.5
  Bottom 0.305: R63.1 82.16,68.52 v82.14,68.5
N$109  (via drill 0.6)
  Top 0.305: U1.39 96.26,70 97.26,69.01 99.64,69.01 100.46,68.2 100.48,68.2 103.76,64.92 103.76,56.84 103.33,56.41 100.13,56.41 v100,56.54
  Bottom 0.305: 98.58,55.08 R66.1 100,56.15 v100,56.54
N$112  (via drill 0.6)
  Top 0.406: 46.02,73.3 R10.1 47.29,72.03 v47.8,72.03 49.28,72.03 50.06,71.25 52.71,71.25 53.42,70.54 54.72,70.54 Q6.2 58.93,69.03 59.41,68.56 60.93,68.56 61.16,68.33 61.16,66.56 R11.1 | v39.45,72.62 39.27,72.62 38.99,72.34 38.99,69.85 37.06,67.92 X8.5
  Bottom 0.406: v39.45,72.62 39.78,72.29 47.55,72.29 v47.8,72.03
N$117  (via drill 0.6)
  Top 0.305: Q7.2 59.34,65.15 59.77,64.72 60.99,64.72 61.14,64.57 R13.1
  Top 0.406: 42.47,66.67 42.47,68.86 43.18,69.57 48.36,69.57 v49.15,68.78 | 42.47,66.67 R12.1 | 42.47,66.67 X8.6 | v53.64,65.89 55.48,65.89 Q7.2
  Bottom 0.406: v49.15,68.78 50.75,68.78 v53.64,65.89
N$145
  Top 0.305: U147.15 U147.16
N$178  (via drill 0.6)
  Top 0.305: 38.94,27.86 R71.2
  Top 0.406: R74.2 v38.85,44.87 v38.86,44.86 | v40.92,41.76 38.9,41.76 | 38.9,41.76 R73.2 40.79,41.81 40.94,41.66 40.94,37.77 v40.92,37.74 | v38.94,30.94 38.94,27.86 v38.91,27.84 | v40.92,24.84 39.13,24.84 R70.2 | R69.2 v40.89,21.11 | R68.2 40.89,17.45 v40.92,17.48 | R67.2 40.89,11.73 v40.94,11.79 40.94,11.2 44.62,7.53 | R56.1 56.95,10.98 | 56.95,10.98 55.73,10.98 U147.1 | 44.62,7.53 45.39,6.76 54.89,6.76 56.92,8.79 56.92,8.81 57.05,8.94 57.05,10.88 56.95,10.98 | 38.9,41.76 38.9,39.47 R72.2 | TP7.TP 44.02,6.93 44.62,7.53
  Bottom 0.406: v38.86,44.86 38.86,43.81 v40.92,41.76 | v40.92,37.74 37.24,37.74 36.42,36.93 36.42,33.96 37.8,32.59 38.53,32.59 38.99,32.13 38.99,30.99 v38.94,30.94 | v38.91,27.84 38.91,26.85 v40.92,24.84 40.89,24.82 v40.89,21.11 40.92,21.08 v40.92,17.48 40.94,17.45 v40.94,11.79
N$180
  Top 0.305: X3.1 35.9,44.46 36.53,45.09 37.12,45.09 R74.1
  Top 0.406: IC8.12 49.14,42.15 48.36,42.93 38.1,42.93 37.16,43.87 37.16,45.05 R74.1
N$181  (via drill 0.6)
  Top 0.305: X3.3 37,41.96 R73.1 | 37.24,41.72 37.24,41.12 v37.21,41.1
  Top 0.406: IC8.14 46.6,39.89 v46.02,40.46 | 37.24,41.72 R73.1
  Bottom 0.305: v37.21,41.1 37.26,41.1 37.74,40.62 45.87,40.62 v46.02,40.46
N$182
  Top 0.254: R72.1 35.25,39.45 X3.5
  Top 0.406: R72.1 37.17,38.09 37.81,38.09 39.14,36.75 39.14,35.1 39.7,34.54 44.45,34.54 45.33,33.67 IC8.15
N$183  (via drill 0.6)
  Top 0.254: R71.1 36.04,29.34 36.04,34.09 37.11,35.15 37.11,35.84 37.11,36.22 36.35,36.98 35.26,36.98 X3.7
  Top 0.406: 50.47,29.7 IC8.11 50.41,35.88 v50.27,36.02 | v37.85,35.84 37.11,35.84
  Bottom 0.406: v50.27,36.02 38.02,36.02 v37.85,35.84
N$184
  Top 0.61: IC8.1 44.06,23.3 43.48,22.73 38.07,22.73 37.15,23.66 R70.1
  Top 0.813: X4.1 36.8,24.21 R70.1
N$185  (via drill 0.6)
  Top 0.305: R69.1 37.25,21.55 v37.36,21.67 | v46.02,27.89 v49.89,27.89 | v49.15,20.09 49.15,23.61 IC8.5
  Top 0.61: X4.3 36.65,21.71 R69.1
  Bottom 0.305: v37.36,21.67 37.36,29.18 37.52,29.34 44.58,29.34 v46.02,27.89 | v49.89,27.89 49.89,20.83 v49.15,20.09
N$186
  Top 0.61: X4.5 36.72,19.21 37.21,18.72 37.21,18.52 | 37.21,18.52 37.21,17.46 R68.1 | IC8.2 45.33,19.27 44.86,18.8 37.49,18.8 37.21,18.52
N$187
  Top 0.406: R67.1 36.89,15.18 37.54,15.82
  Top 0.61: IC8.4 47.87,17.67 47.24,17.04 42.75,17.04 41.53,15.82 37.54,15.82 37.44,15.82 36.55,16.71 X4.7
N$199
  Top 0.254: U1.25 85.36,63 84.71,62.36
  Top 0.305: 84.71,62.36 79.76,62.36 79.27,61.87 79.27,38.76 78.71,38.2
  Top 0.406: R47.2 59.6,33.8 60.45,32.94 66.6,32.94 67.18,33.53 68.58,33.53 69.19,32.92 73.43,32.92 78.71,38.2
Q12  (via drill 0.6)
  Top 0.406: v39.83,51.44 38.49,51.44 R24.2 | Q12.3 53.19,44.68 v52.32,45.54
  Bottom 0.406: 39.85,51.41 v39.83,51.44 39.95,51.31 40.39,51.31 46.15,45.54 v52.32,45.54
V+  (via drill 0.6)
  Top 0.305: U1.1 77.64,74.5 76.71,75.44 76.71,80.06 76.25,80.52 v75.59,80.52
  Top 1.27: Z1.C 67.86,4.35 C41.1 65.1,5.31 64.47,5.94 64.47,11.51 65.07,12.12 66.6,12.12 | R32.1 69.84,12.12 66.6,12.12 | 66.6,12.12 66.04,12.68 66.04,20.7 75.21,20.7 v75.23,20.68
  Bottom 1.27: v75.59,80.52 75.29,80.21 75.29,23.75 75.23,23.7 v75.23,20.68
V-  (via drill 0.6)
  Top 0.254: U1.30 85.38,65.51 85.09,65.51 85.09,65.96 | 85.09,65.96 85.08,66 U1.31 | 85.09,65.96 84.68,65.99 v84.99,65.94
  Top 0.305: C17.2 64.9,30.1 C17.2 | C16.2 64.78,34 v64.77,34.04 | C15.2 64.73,38.04 v64.82,38.05 | C14.2 64.76,41.92 v64.8,41.91 | C13.2 64.62,45.75 C13.2 | C12.2 64.71,49.65 v64.77,49.66 | C10.2 64.9,57.48 v64.82,57.53 | C8.2 65.51,61.6 v66.24,62.33 | C7.2 65.13,65.74 C7.2 | C5.2 64.9,69.78 v64.92,69.8 | R79.2 88.3,75.81 v88.37,76.02 | D19.A 72.19,27.41 v72.24,27.46 | R60.1 61.08,7.58 61.09,7.57 60.93,7.57 60.68,7.32 61.01,7.32 v61.06,7.37 | C11.2 64.67,53.59 C11.2
  Top 0.406: R85.1 v96.69,61.12 | C18.2 81.78,56.29 v81.75,56.26 | C19.2 81.71,54.25 v81.72,54.27 | C42.2 55.88,9.84 v55.89,9.83 | C4.2 64.78,74.16 v64.9,74.14 | C9.2 | R61.2 92.91,73.91 v91.21,75.23 | U147.13 U147.14 48.07,12.92 v46.81,11.66 46.74,11.58 43.36,11.58 43.13,11.81 R59.1 | R55.1 51.19,20.59 v51.79,21.18 | IC8.6 50.41,22.57 v51.79,21.18 | IC8.7 51.68,21.3 v51.79,21.18 | IC8.8 52.95,22.34 v51.79,21.18
  Top 0.61: v85.09,75.74 R80.2 | v81.92,75.79 R81.2 | R82.2 v78.84,75.79 | C22.2 98.78,80.06 v98.81,80.09 | C23.2 v101.98,80.03 | v45.72,8.97 45.72,10.49 46.46,11.23 46.46,11.3 v46.81,11.66
  Top 0.813: R28.1 38.5,47.65 35.43,47.65 | 35.43,47.65 v35.26,47.47 | v32.79,45.01 32.79,43.69 33.3,43.18 35.21,43.18 X3.2 33.38,43.21 32.74,42.57 32.74,41 32.99,40.74 35.2,40.74 X3.4 33.47,40.71 32.69,39.93 32.69,38.35 32.82,38.23 35.22,38.23 X3.6 33.46,38.21 32.66,37.41 32.66,35.79 32.72,35.74 35.21,35.74 X3.8 35.24,35.01 34.8,34.57 34.8,31.45 v32.99,29.64 | v32.99,22.99 35.44,22.99 X4.2 33.48,22.96 32.92,22.4 32.92,20.83 32.94,20.83 33.27,20.5 35.43,20.5 X4.4 33.57,20.46 32.92,19.81 32.92,18.26 33.2,17.98 35.45,17.98 X4.6 33.56,17.96 32.87,17.27 32.87,15.65 33.05,15.47 X4.8 | 35.43,47.65 35.43,48.23 35.99,48.79 35.99,52.38 36.27,52.65 36.27,56.54 35.62,56.54 X8.14 | C50.2 100.84,58.98 v102.77,57.94 102.9,57.96 | C6.2 40.09,26.78 39.37,26.06 36.5,26.06 v35.79,26.77
  Top 1.27: R28.1 40.89,47.05 v40.87,47.07 | U$15.P$1 86.39,7.16 v85.85,6.63 | v76.81,8.1 74.9,8.1 C2.2 | C2.2 69.94,8.05 Z1.A 66.95,8.15 C41.2 | C2.2 74.85,11.28 C1.- | C43.2 113.51,70.79 v113.41,70.69
  Bottom 0.254: v84.99,65.94 85.37,65.81
  Bottom 0.305: C17.2 64.74,30.1 | v64.77,34.04 C16.2 64.8,33.98 | v64.82,38.05 64.8,38.02 | v64.8,41.91 64.82,41.91 64.85,41.88 | C13.2 64.82,45.77 | v64.77,49.66 64.87,49.58 | C11.2 64.9,53.62 | v64.82,57.53 64.74,57.56 64.8,57.51 | v66.24,62.33 66.62,62.33 | C7.2 64.92,65.61 | v64.92,69.8 64.97,69.83 | v72.24,27.46 71.54,27.46 R87.1 | v61.06,7.37 61.06,7.49 61.09,7.52
  Bottom 0.406: v81.75,56.26 81.62,56.26 81.56,56.33 | v81.72,54.27 81.71,54.29 | v55.89,9.83 55.74,9.75 | v64.9,74.14 64.95,74.17 64.9,74.12 | C9.2 64.8,79.1 | v91.21,75.23 91.29,75.34 91.26,75.36 | v51.79,21.18 51.79,21.21 51.77,21.23 | v46.81,11.66 46.81,11.58 46.46,11.23
  Bottom 0.61: v98.81,80.09 98.81,80.34 | v101.98,80.03 101.98,80.09
  Bottom 0.813: v35.26,47.47 v32.79,45.01 | v32.99,29.64 v32.99,22.99 | v35.79,26.77 35.81,26.95
  Bottom 1.27: v40.87,47.07 40.87,47.27 40.79,47.27 | v85.85,6.63 85.65,6.63 85.34,6.33 85.34,6.38 | v113.41,70.69 113.08,70.69
  other vias: 64.82,30.1 64.77,45.77 64.77,53.57 64.87,65.74 64.82,79.07 86.36,7.92 86.36,9.25 72.11,8.05 68.55,8.18
  pour Bottom (isolate 0.406): 117.25,85.75 117.12,65.63 105.89,65.66 105.99,60.71 105.99,52.5 97.64,52.53 90.53,52.53 90.83,0.51 39.24,0.51 30.15,0.53 30.15,7.87 30.2,8.46 30.15,9.19 30.25,9.63 30.18,9.7 30.18,85.7
VREG  (via drill 0.6)
  Top 0.254: U1.37 84.54,69 84.35,69.19 84.35,70.48 84.38,70.5 | 85.17,80.53 R75.1 81.99,80.45 R77.1 78.89,80.53 R78.1
  Top 0.305: U1.40 84.38,70.5 82.42,70.5 v82.14,70.23 | 100.8,61.69 C50.1 | U1.37 91.17,69 91.73,68.44 | 85.17,80.53 88.09,80.53 R76.1 | 81.99,80.45 90.06,80.45 90.35,80.16 90.4,80.16 v90.93,79.63
  Top 0.406: 91.67,68.71 91.77,68.4 | v98.96,51.1 98.96,51.33 98.5,51.79 | R65.2 R64.2 | 53.34,11.84 53.26,11.76 52.37,11.76 50.96,10.35 C42.1 49.73,8.59 VREG.TP | U147.4 53.51,13.57 53.34,13.74
  Top 0.61: IC8.16 44.06,27.6 44.09,27.56 | R65.2 55.14,33.81 55.85,33.1 55.85,27.74 56.03,27.56 | 53.34,11.84 53.34,13.74 53.34,16.36 54.99,18.01 54.99,26.85 54.99,27.46 54.89,27.56 | v92.2,68.2 91.52,68.66 91.73,68.44 91.77,68.4 | v97.33,66.14 98.17,66.14 100.81,63.5 100.81,61.83 C50.1
  Top 0.813: Q21.3 98.35,51.64 98.5,51.79 98.91,52.2 98.91,59.56 | 98.91,59.56 98.91,61.34 100.8,61.69 | 94.82,59.59 98.88,59.59 98.91,59.56
  Top 1.27: 94.82,59.59 92.23,57 92.23,54.94 89.94,52.65 89.94,30.1 85.29,25.45 80.57,25.45 78.79,23.67 59.92,23.67 56.03,27.56 | C6.1 43.34,29.58 43.41,29.52 43.41,27.64 43.33,27.56 44.09,27.56 44.09,26.26 44.53,25.83 53.98,25.83 54.99,26.85 | 54.89,27.56 55.68,27.56 55.85,27.74
  Bottom 0.305: R63.2 82.16,70.22 v82.14,70.23 | v90.93,79.63 90.93,77.06 90.04,76.17
  Bottom 0.406: R66.2 98.76,51.31 v98.96,51.1
  Bottom 0.61: 90.04,76.17 90.04,76.15 89.89,76 89.89,70.28 90.53,69.65 91.92,68.28 v92.2,68.2 92.2,67.77 92.91,67.06 93.14,67.06 93.37,66.83 94.74,66.83 94.77,66.8 94.77,66.73 95.3,66.19 97.28,66.19 v97.33,66.14

## Text on the board
tPlace: 12 Cell BMS ISO-SPI Slave | Use Cable Ties to Support Connectors | Revision 2.1 | Made in New Zealand by Chris Young